# Altium schematic sheet v1.0.SchDoc
size 106 x 63 mm
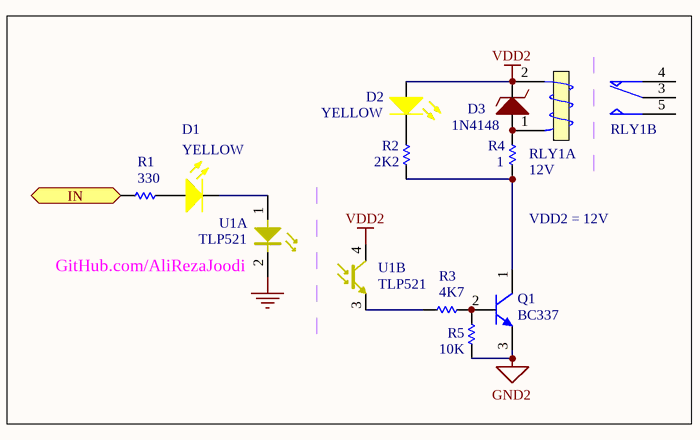
[diagram p0: v1.0.SchDoc]

## Parts
D1  YELLOW  [LED_THD_3MM_YELLOW_R]
D2  YELLOW  [LED_THD_3MM_YELLOW_R]
D3  1N4148  [D_THD_AXIAL0.3_DO-35]
Q1  BC337  [TO92C]
R1  330  [R_THD_AXIAL0.4(1/4W)]
R2  2K2  [R_THD_AXIAL0.4(1/4W)]
R3  4K7  [R_THD_AXIAL0.4(1/4W)]
R4  1  [R_THD_AXIAL0.4(1/4W)]
R5  10K  [R_THD_AXIAL0.4(1/4W)]
RLY1  12V  [RELAY_SPDT_5PIN_2216]  (parts A,B of 2)
U1  TLP521  [DIP_4]  (parts A,B of 2)

## Ports
IN (in)

## Nets
GND: U1.2(K)
GND2: Q1.3(E) R5.2
VDD2: D2.1(A) D3.2 RLY1.2(T1) U1.4(C)
IN: R1.2 ; port IN
NetD1_1: D1.1(A) R1.1
NetD1_2: D1.2(K) U1.1(A)
NetD2_2: D2.2(K) R2.2
NetD3_1: D3.1 R4.2 RLY1.1(T2)
NetQ1_1: Q1.1(C) R2.1 R4.1
NetQ1_2: Q1.2(B) R3.1 R5.1
NetR3_2: R3.2 U1.3(E)

Not connected (* = marked no-connect by the designer): RLY1 3(COM) 4(NC) 5(NO)

## Notes on the sheet
- (near U1) GitHub.com/AliRezaJoodi
- VDD2 = 12V

## Library data of the parts
D1 D2 = LED_YELLOW: LED, Yellow; Manufacturer: Generic Components; Class I: Optoelectronic; Published: 8-Jun-2000; Revision: July-2002: Re-released for DXP Platform.; Publisher: Altium Limited; Class II: LED
D3 = Diode_Zener: Diode, Zener; Revision: July-2002: Re-released for DXP Platform.
Q1 = NPN: NPN Bipolar Transistor; Manufacturer: Generic Components; Class I: Discrete; Class II: BJT - Low Power; Published: 8-Jun-2000; Revision: July-2002: Re-released for DXP Platform.; Publisher: Altium Limited
R1-R5 = Resistor: Revision: July-2002: Re-released for DXP Platform.
RLY1 = Relay_SPDT_2Form: SPDT Relay
U1 = Optoisolator: Publisher: Altium Limited